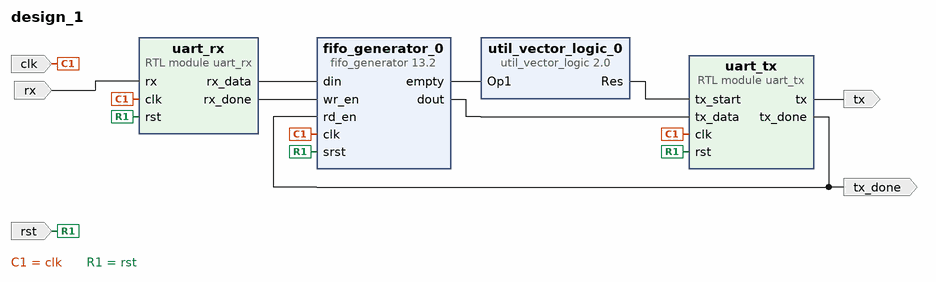
[diagram p0: block diagram of the top level]
# Vivado block design design_1, xc7z020clg484-1, Vivado 2021.2
create_bd_design design_1

create_bd_port -dir I rx
create_bd_port -dir O tx
create_bd_port -dir I -type clk clk
create_bd_port -dir I -type rst rst
create_bd_port -dir O tx_done

create_bd_cell -type module -reference uart_tx uart_tx
create_bd_cell -type module -reference uart_rx uart_rx
create_bd_cell -type ip -vlnv xilinx.com:ip:fifo_generator:13.2 fifo_generator_0
set_property -dict [list \
  CONFIG.Input_Data_Width 8 \
  CONFIG.Output_Data_Width 8 \
  CONFIG.Performance_Options First_Word_Fall_Through \
] [get_bd_cells fifo_generator_0]
create_bd_cell -type ip -vlnv xilinx.com:ip:util_vector_logic:2.0 util_vector_logic_0
set_property -dict {CONFIG.C_OPERATION not} [get_bd_cells util_vector_logic_0]

# ---- connections ----

connect_bd_net -net clk_0_1 [get_bd_ports clk] [get_bd_pins uart_tx/clk] [get_bd_pins uart_rx/clk] [get_bd_pins fifo_generator_0/clk]
connect_bd_net [get_bd_pins fifo_generator_0/dout] [get_bd_pins uart_tx/tx_data]
connect_bd_net [get_bd_pins fifo_generator_0/empty] [get_bd_pins util_vector_logic_0/Op1]
connect_bd_net -net rst_0_1 [get_bd_ports rst] [get_bd_pins uart_tx/rst] [get_bd_pins uart_rx/rst] [get_bd_pins fifo_generator_0/srst]
connect_bd_net [get_bd_ports rx] [get_bd_pins uart_rx/rx]
connect_bd_net -net uart_rx_0_rx_data [get_bd_pins uart_rx/rx_data] [get_bd_pins fifo_generator_0/din]
connect_bd_net -net uart_rx_0_rx_done [get_bd_pins uart_rx/rx_done] [get_bd_pins fifo_generator_0/wr_en]
connect_bd_net -net uart_tx_0_tx [get_bd_pins uart_tx/tx] [get_bd_ports tx]
connect_bd_net -net uart_tx_0_tx_done [get_bd_pins uart_tx/tx_done] [get_bd_ports tx_done] [get_bd_pins fifo_generator_0/rd_en]
connect_bd_net [get_bd_pins util_vector_logic_0/Res] [get_bd_pins uart_tx/tx_start]

validate_bd_design
save_bd_design
